# Altium schematic sheet digital_io.SchDoc
size A3; SheetNumber: 8; SheetTotal: 15; SheetDescription: Digital IO
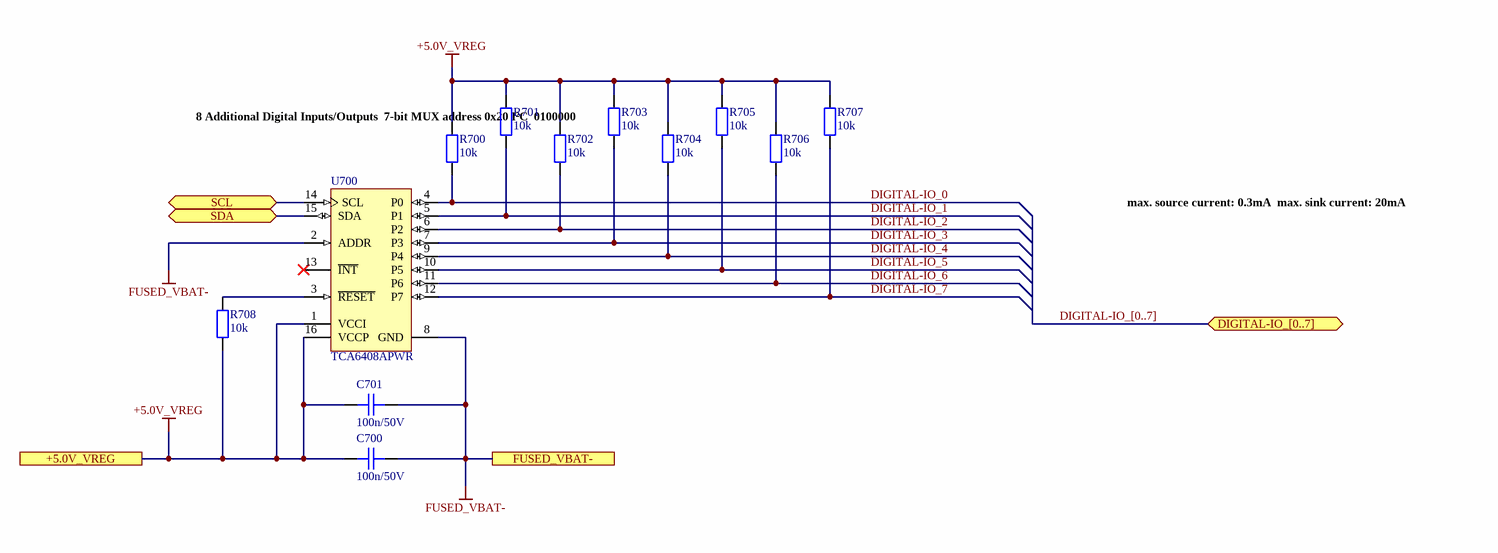
[diagram p0: digital_io.SchDoc]

## Parts
C700  100n/50V  [CAPC1608X08N]
C701  100n/50V  [CAPC1608X08N]
R700  10k  [RESC1608X05N]
R701  10k  [RESC1608X05N]
R702  10k  [RESC1608X05N]
R703  10k  [RESC1608X05N]
R704  10k  [RESC1608X05N]
R705  10k  [RESC1608X05N]
R706  10k  [RESC1608X05N]
R707  10k  [RESC1608X05N]
R708  10k  [RESC1608X05N]
U700  TCA6408APWR  [PW0016A_L]

## Ports
+5.0V_VREG, DIGITAL-IO_[0..7] (bidir), FUSED_VBAT-, SCL (bidir), SDA (bidir)

## Nets
+5.0V_VREG: C700.2 C701.2 R700.2 R701.2 R702.2 R703.2 R704.2 R705.2 R706.2 R707.2 R708.1 U700.1(VCCI) U700.16(VCCP) ; port +5.0V_VREG
FUSED_VBAT-: C700.1 C701.1 U700.2(ADDR) U700.8(GND) ; port FUSED_VBAT-
DIGITAL-IO_0: R700.1 U700.4(P0)
DIGITAL-IO_1: R701.1 U700.5(P1)
DIGITAL-IO_2: R702.1 U700.6(P2)
DIGITAL-IO_3: R703.1 U700.7(P3)
DIGITAL-IO_4: R704.1 U700.9(P4)
DIGITAL-IO_5: R705.1 U700.10(P5)
DIGITAL-IO_6: R706.1 U700.11(P6)
DIGITAL-IO_7: R707.1 U700.12(P7)
SCL: U700.14(SCL) ; port SCL
SDA: U700.15(SDA) ; port SDA
NetR708_2: R708.2 U700.3(~{RESET})

Not connected (* = marked no-connect by the designer): U700 13(~{INT})*

## Buses and harness runs
bus DIGITAL-IO_[0..7] = port DIGITAL-IO_[0..7]

## Notes on the sheet
- 8 Additional Digital Inputs/Outputs
  7-bit MUX address 0x20 I²C
  0100000
- max. source current: 0.3mA
  max. sink current: 20mA
- Fraunhofer IISB
- Schottkystr. 10
- developed by:
- 91058 Erlangen
- Germany
- Author
- Project
- License
- Description
- File
- Version
- Release Date
- Sheet
- foxbms.org <https://foxbms.org>
- www.iisb.fraunhofer.de <https://www.iisb.fraunhofer.de/>
- foxBMS Team
- /

## Library data of the parts
C700 C701 = gen_C_ceramic_100n_50V_X7R_0603: MLCC; Capacitance: 100n; Rated Voltage: 50V; Dielectric: X7R; Case EIA: 0603; Case Metric: 1608; PnP Package: C_0603_10; PnP Value: 100n/50V/X7R; PnP equipped: x; Automotive Qualified: True; Part Number: gen_C_ceramic_100n_50V_X7R_0603; Supplier 1: Farnell; Supplier Part Number 1: 2525267; Supplier 2: Digikey; Supplier Part Number 2: 490-6049-1-ND; Supplier 3: Farnell; Supplier Part Number 3: 2070398
R700-R708 = gen_R_10k_0603: SMD Resistor 10k 0603; Tolerance: 1%; Power: 0.1W; Case EIA: 0603; Case Metric: 1608; Maximum Working Voltage: 75V; PnP Package: R_0603; Automotive Qualified: True; Part Number: gen_R_10k_0603; Operating Temperature: -55°C - +155°C; Resistance: 10k; Series: E24, E96; PnP Value: 10k; Supplier 1: Farnell; Supplier Part Number 1: 2073349
U700 = CMP-0314-00338-2: Low-Voltage 8-Bit I2C and SMBus I/O Expander, 1.65 to 5.5 V, -40 to 85 degC, 16-pin TSSOP (PW), Green (RoHS & no Sb/Br); Manufacturer: Texas Instruments; Push-Pull I/O Type: Yes; Max Frequency(kHz): 400; No. of Outputs: 8; VCC(Min)(V): 1.65; SubFamily: I2C IO Expander; I2C Address: 0100 00x; VCC(Max)(V): 5.5; Vcc range(V): 1.65 to 5.5; PackageDescription: 16-Pin Plastic Thin Small Outline Package 5 x 4.4 mm Body ,0.65 mm Pitch; PartNumber: TCA6408APWR; Configuration Registers: Yes; Eco-Plan: Green (RoHS & no Sb/Br); ComponentLink1Description: Datasheet; Low Power: Yes; ComponentLink1URL: http://www.ti.com/general/docs/lit/getliterature.tsp?genericPartNumber=TCA6408A&fileType=pdf; 5V Tolerant I/O: Yes; Code_JEDEC: MO-153; Interrupt Output: Yes; PackageVersion: revG, Feb-2011; # of I/Os: 8; Reset Input: Yes; fSCLK(Max)(MHz): 400; PackageReference: PW0016A; Mounting Technology: Surface Mount; DatasheetVersion: SCPS192C